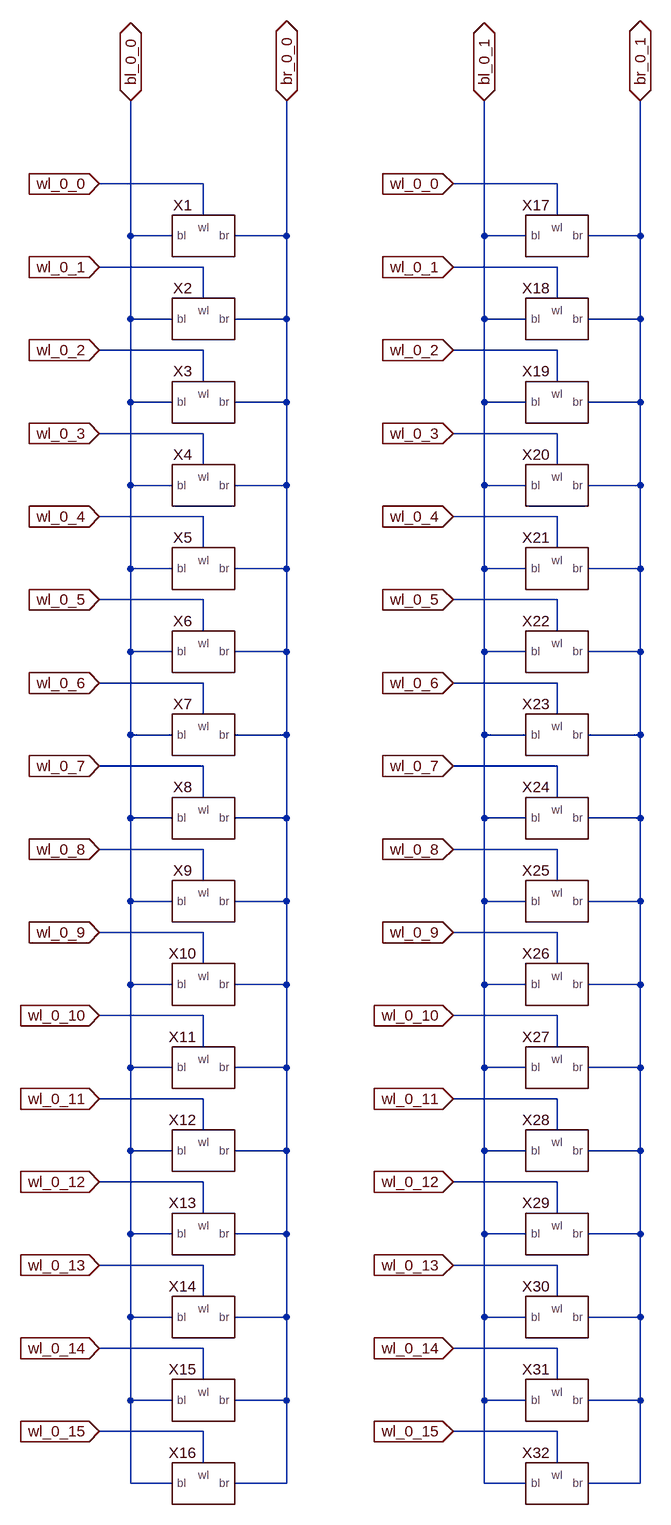
[diagram p0: schematic sram_16x2_bitcell_array.asc]
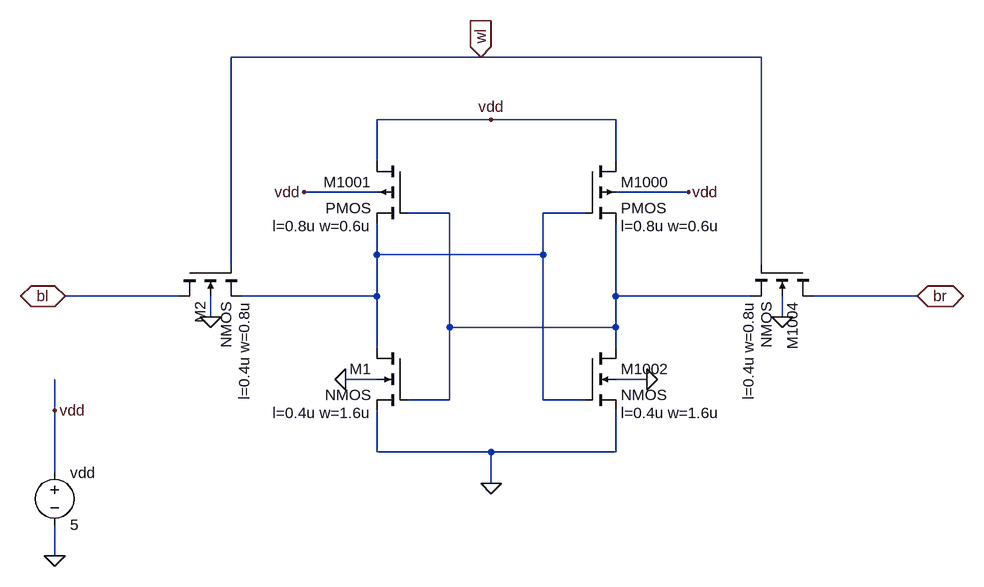
[diagram p1: sub-circuit cell_1rw.asc]
sram_16x2_bitcell_array.asc, the LTspice schematic file:
Version 4
SHEET 1 880 2100
WIRE 112 64 -48 64
WIRE 656 64 496 64
WIRE 112 112 112 64
WIRE 656 112 656 64
WIRE 0 144 0 -64
WIRE 64 144 0 144
WIRE 240 144 240 -64
WIRE 240 144 160 144
WIRE 544 144 544 -64
WIRE 608 144 544 144
WIRE 784 144 784 -64
WIRE 784 144 704 144
WIRE 112 192 -48 192
WIRE 656 192 496 192
WIRE 112 240 112 192
WIRE 656 240 656 192
WIRE 0 272 0 144
WIRE 64 272 0 272
WIRE 240 272 240 144
WIRE 240 272 160 272
WIRE 544 272 544 144
WIRE 608 272 544 272
WIRE 784 272 784 144
WIRE 784 272 704 272
WIRE 112 320 -48 320
WIRE 656 320 496 320
WIRE 112 368 112 320
WIRE 656 368 656 320
WIRE 0 400 0 272
WIRE 64 400 0 400
WIRE 240 400 240 272
WIRE 240 400 160 400
WIRE 544 400 544 272
WIRE 608 400 544 400
WIRE 784 400 784 272
WIRE 784 400 704 400
WIRE 112 448 -48 448
WIRE 656 448 496 448
WIRE 112 496 112 448
WIRE 656 496 656 448
WIRE 0 528 0 400
WIRE 64 528 0 528
WIRE 240 528 240 400
WIRE 240 528 160 528
WIRE 544 528 544 400
WIRE 608 528 544 528
WIRE 784 528 784 400
WIRE 784 528 704 528
WIRE 112 576 -48 576
WIRE 656 576 496 576
WIRE 112 624 112 576
WIRE 656 624 656 576
WIRE 0 656 0 528
WIRE 64 656 0 656
WIRE 240 656 240 528
WIRE 240 656 160 656
WIRE 544 656 544 528
WIRE 608 656 544 656
WIRE 784 656 784 528
WIRE 784 656 704 656
WIRE 112 704 -48 704
WIRE 656 704 496 704
WIRE 112 752 112 704
WIRE 656 752 656 704
WIRE 0 784 0 656
WIRE 64 784 0 784
WIRE 240 784 240 656
WIRE 240 784 160 784
WIRE 544 784 544 656
WIRE 608 784 544 784
WIRE 784 784 784 656
WIRE 784 784 704 784
WIRE 112 832 -48 832
WIRE 656 832 496 832
WIRE 112 880 112 832
WIRE 656 880 656 832
WIRE 0 912 0 784
WIRE 64 912 0 912
WIRE 240 912 240 784
WIRE 240 912 160 912
WIRE 544 912 544 784
WIRE 608 912 544 912
WIRE 784 912 784 784
WIRE 784 912 704 912
WIRE 112 960 -48 960
WIRE 656 960 496 960
WIRE 112 1008 112 960
WIRE 656 1008 656 960
WIRE 0 1040 0 912
WIRE 64 1040 0 1040
WIRE 240 1040 240 912
WIRE 240 1040 160 1040
WIRE 544 1040 544 912
WIRE 608 1040 544 1040
WIRE 784 1040 784 912
WIRE 784 1040 704 1040
WIRE 112 1088 -48 1088
WIRE 656 1088 496 1088
WIRE 112 1136 112 1088
WIRE 656 1136 656 1088
WIRE 0 1168 0 1040
WIRE 64 1168 0 1168
WIRE 240 1168 240 1040
WIRE 240 1168 160 1168
WIRE 544 1168 544 1040
WIRE 608 1168 544 1168
WIRE 784 1168 784 1040
WIRE 784 1168 704 1168
WIRE 112 1216 -48 1216
WIRE 656 1216 496 1216
WIRE 112 1264 112 1216
WIRE 656 1264 656 1216
WIRE 0 1296 0 1168
WIRE 64 1296 0 1296
WIRE 240 1296 240 1168
WIRE 240 1296 160 1296
WIRE 544 1296 544 1168
WIRE 608 1296 544 1296
WIRE 784 1296 784 1168
WIRE 784 1296 704 1296
WIRE 112 1344 -48 1344
WIRE 656 1344 496 1344
WIRE 112 1392 112 1344
WIRE 656 1392 656 1344
WIRE 0 1424 0 1296
WIRE 64 1424 0 1424
WIRE 240 1424 240 1296
WIRE 240 1424 160 1424
WIRE 544 1424 544 1296
WIRE 608 1424 544 1424
WIRE 784 1424 784 1296
WIRE 784 1424 704 1424
WIRE 112 1472 -48 1472
WIRE 656 1472 496 1472
WIRE 112 1520 112 1472
WIRE 656 1520 656 1472
WIRE 0 1552 0 1424
WIRE 64 1552 0 1552
WIRE 240 1552 240 1424
WIRE 240 1552 160 1552
WIRE 544 1552 544 1424
WIRE 608 1552 544 1552
WIRE 784 1552 784 1424
WIRE 784 1552 704 1552
WIRE 112 1600 -48 1600
WIRE 656 1600 496 1600
WIRE 112 1648 112 1600
WIRE 656 1648 656 1600
WIRE 0 1680 0 1552
WIRE 64 1680 0 1680
WIRE 240 1680 240 1552
WIRE 240 1680 160 1680
WIRE 544 1680 544 1552
WIRE 608 1680 544 1680
WIRE 784 1680 784 1552
WIRE 784 1680 704 1680
WIRE 112 1728 -48 1728
WIRE 656 1728 496 1728
WIRE 112 1776 112 1728
WIRE 656 1776 656 1728
WIRE 0 1808 0 1680
WIRE 64 1808 0 1808
WIRE 240 1808 240 1680
WIRE 240 1808 160 1808
WIRE 544 1808 544 1680
WIRE 608 1808 544 1808
WIRE 784 1808 784 1680
WIRE 784 1808 704 1808
WIRE 112 1856 -48 1856
WIRE 656 1856 496 1856
WIRE 112 1904 112 1856
WIRE 656 1904 656 1856
WIRE 0 1936 0 1808
WIRE 64 1936 0 1936
WIRE 240 1936 240 1808
WIRE 240 1936 160 1936
WIRE 544 1936 544 1808
WIRE 608 1936 544 1936
WIRE 784 1936 784 1808
WIRE 784 1936 704 1936
WIRE 112 1984 -48 1984
WIRE 656 1984 496 1984
WIRE 112 2032 112 1984
WIRE 656 2032 656 1984
WIRE 0 2064 0 1936
WIRE 64 2064 0 2064
WIRE 240 2064 240 1936
WIRE 240 2064 160 2064
WIRE 544 2064 544 1936
WIRE 608 2064 544 2064
WIRE 784 2064 784 1936
WIRE 784 2064 704 2064
FLAG -48 64 wl_0_0
IOPIN -48 64 In
FLAG -48 192 wl_0_1
IOPIN -48 192 In
FLAG -48 320 wl_0_2
IOPIN -48 320 In
FLAG -48 448 wl_0_3
IOPIN -48 448 In
FLAG -48 576 wl_0_4
IOPIN -48 576 In
FLAG -48 704 wl_0_5
IOPIN -48 704 In
FLAG -48 832 wl_0_6
IOPIN -48 832 In
FLAG -48 960 wl_0_7
IOPIN -48 960 In
FLAG -48 1088 wl_0_8
IOPIN -48 1088 In
FLAG -48 1216 wl_0_9
IOPIN -48 1216 In
FLAG -48 1344 wl_0_10
IOPIN -48 1344 In
FLAG -48 1472 wl_0_11
IOPIN -48 1472 In
FLAG -48 1600 wl_0_12
IOPIN -48 1600 In
FLAG -48 1728 wl_0_13
IOPIN -48 1728 In
FLAG -48 1856 wl_0_14
IOPIN -48 1856 In
FLAG -48 1984 wl_0_15
IOPIN -48 1984 In
FLAG 0 -64 bl_0_0
IOPIN 0 -64 BiDir
FLAG 240 -64 br_0_0
IOPIN 240 -64 BiDir
FLAG 496 64 wl_0_0
IOPIN 496 64 In
FLAG 496 192 wl_0_1
IOPIN 496 192 In
FLAG 496 320 wl_0_2
IOPIN 496 320 In
FLAG 496 448 wl_0_3
IOPIN 496 448 In
FLAG 496 576 wl_0_4
IOPIN 496 576 In
FLAG 496 704 wl_0_5
IOPIN 496 704 In
FLAG 496 832 wl_0_6
IOPIN 496 832 In
FLAG 496 960 wl_0_7
IOPIN 496 960 In
FLAG 496 1088 wl_0_8
IOPIN 496 1088 In
FLAG 496 1216 wl_0_9
IOPIN 496 1216 In
FLAG 496 1344 wl_0_10
IOPIN 496 1344 In
FLAG 496 1472 wl_0_11
IOPIN 496 1472 In
FLAG 496 1600 wl_0_12
IOPIN 496 1600 In
FLAG 496 1728 wl_0_13
IOPIN 496 1728 In
FLAG 496 1856 wl_0_14
IOPIN 496 1856 In
FLAG 496 1984 wl_0_15
IOPIN 496 1984 In
FLAG 544 -64 bl_0_1
IOPIN 544 -64 BiDir
FLAG 784 -64 br_0_1
IOPIN 784 -64 BiDir
SYMBOL cell_1rw 112 144 R0
SYMATTR InstName X1
SYMBOL cell_1rw 112 272 R0
SYMATTR InstName X2
SYMBOL cell_1rw 112 400 R0
SYMATTR InstName X3
SYMBOL cell_1rw 112 528 R0
SYMATTR InstName X4
SYMBOL cell_1rw 112 656 R0
SYMATTR InstName X5
SYMBOL cell_1rw 112 784 R0
SYMATTR InstName X6
SYMBOL cell_1rw 112 912 R0
SYMATTR InstName X7
SYMBOL cell_1rw 112 1040 R0
SYMATTR InstName X8
SYMBOL cell_1rw 112 1168 R0
SYMATTR InstName X9
SYMBOL cell_1rw 112 1296 R0
SYMATTR InstName X10
SYMBOL cell_1rw 112 1424 R0
SYMATTR InstName X11
SYMBOL cell_1rw 112 1552 R0
SYMATTR InstName X12
SYMBOL cell_1rw 112 1680 R0
SYMATTR InstName X13
SYMBOL cell_1rw 112 1808 R0
SYMATTR InstName X14
SYMBOL cell_1rw 112 1936 R0
SYMATTR InstName X15
SYMBOL cell_1rw 112 2064 R0
SYMATTR InstName X16
SYMBOL cell_1rw 656 144 R0
SYMATTR InstName X17
SYMBOL cell_1rw 656 272 R0
SYMATTR InstName X18
SYMBOL cell_1rw 656 400 R0
SYMATTR InstName X19
SYMBOL cell_1rw 656 528 R0
SYMATTR InstName X20
SYMBOL cell_1rw 656 656 R0
SYMATTR InstName X21
SYMBOL cell_1rw 656 784 R0
SYMATTR InstName X22
SYMBOL cell_1rw 656 912 R0
SYMATTR InstName X23
SYMBOL cell_1rw 656 1040 R0
SYMATTR InstName X24
SYMBOL cell_1rw 656 1168 R0
SYMATTR InstName X25
SYMBOL cell_1rw 656 1296 R0
SYMATTR InstName X26
SYMBOL cell_1rw 656 1424 R0
SYMATTR InstName X27
SYMBOL cell_1rw 656 1552 R0
SYMATTR InstName X28
SYMBOL cell_1rw 656 1680 R0
SYMATTR InstName X29
SYMBOL cell_1rw 656 1808 R0
SYMATTR InstName X30
SYMBOL cell_1rw 656 1936 R0
SYMATTR InstName X31
SYMBOL cell_1rw 656 2064 R0
SYMATTR InstName X32

cell_1rw.asc, the sub-circuit schematic file:
Version 4
SHEET 1 916 708
WIRE 160 -80 -224 -80
WIRE 592 -80 160 -80
WIRE 176 16 0 16
WIRE 368 16 176 16
WIRE 0 80 0 16
WIRE 368 80 368 16
WIRE 0 128 -112 128
WIRE 480 128 368 128
WIRE 112 160 48 160
WIRE 320 160 256 160
WIRE 0 224 0 176
WIRE 256 224 256 160
WIRE 256 224 0 224
WIRE -224 240 -224 -80
WIRE 592 240 592 -80
WIRE -304 288 -480 288
WIRE 0 288 0 224
WIRE 0 288 -208 288
WIRE 368 288 368 176
WIRE 576 288 368 288
WIRE 832 288 672 288
WIRE -256 320 -256 288
WIRE 624 320 624 288
WIRE 112 336 112 160
WIRE 368 336 368 288
WIRE 368 336 112 336
WIRE 0 368 0 288
WIRE 368 368 368 336
WIRE 0 416 -48 416
WIRE 416 416 368 416
WIRE 112 448 112 336
WIRE 112 448 48 448
WIRE 256 448 256 224
WIRE 320 448 256 448
WIRE -496 464 -496 416
WIRE 0 528 0 464
WIRE 176 528 0 528
WIRE 368 528 368 464
WIRE 368 528 176 528
WIRE -496 560 -496 464
WIRE 176 576 176 528
WIRE -496 688 -496 640
FLAG 176 576 0
FLAG -496 688 0
FLAG -496 464 vdd
FLAG 176 16 vdd
FLAG 416 416 0
FLAG -48 416 0
FLAG 624 320 0
FLAG -256 320 0
FLAG -112 128 vdd
FLAG 480 128 vdd
FLAG -480 288 bl
IOPIN -480 288 BiDir
FLAG 160 -80 wl
IOPIN 160 -80 In
FLAG 832 288 br
IOPIN 832 288 BiDir
SYMBOL pmos4 320 80 R0
WINDOW 123 56 100 Left 2
SYMATTR InstName M1000
SYMATTR Value2 l=0.8u w=0.6u
SYMBOL pmos4 48 80 M0
WINDOW 123 56 100 Left 2
SYMATTR InstName M1001
SYMATTR Value2 l=0.8u w=0.6u
SYMBOL nmos4 320 368 R0
WINDOW 123 56 100 Left 2
SYMATTR InstName M1002
SYMATTR Value2 l=0.4u w=1.6u
SYMBOL nmos4 48 368 M0
WINDOW 123 56 100 Left 2
SYMATTR InstName M1
SYMATTR Value2 l=0.4u w=1.6u
SYMBOL voltage -496 544 R0
WINDOW 123 0 0 Left 0
WINDOW 39 0 0 Left 0
SYMATTR InstName vdd
SYMATTR Value 5
SYMBOL nmos4 672 240 R90
WINDOW 123 56 100 Left 2
SYMATTR InstName M1004
SYMATTR Value2 l=0.4u w=0.8u
SYMBOL nmos4 -304 240 M90
WINDOW 123 56 100 Left 2
SYMATTR InstName M2
SYMATTR Value2 l=0.4u w=0.8u

The netlist it stands for:
* sram_16x2_bitcell_array.asc
XX1 wl_0_0 bl_0_0 br_0_0 cell_1rw
XX2 wl_0_1 bl_0_0 br_0_0 cell_1rw
XX3 wl_0_2 bl_0_0 br_0_0 cell_1rw
XX4 wl_0_3 bl_0_0 br_0_0 cell_1rw
XX5 wl_0_4 bl_0_0 br_0_0 cell_1rw
XX6 wl_0_5 bl_0_0 br_0_0 cell_1rw
XX7 wl_0_6 bl_0_0 br_0_0 cell_1rw
XX8 wl_0_7 bl_0_0 br_0_0 cell_1rw
XX9 wl_0_8 bl_0_0 br_0_0 cell_1rw
XX10 wl_0_9 bl_0_0 br_0_0 cell_1rw
XX11 wl_0_10 bl_0_0 br_0_0 cell_1rw
XX12 wl_0_11 bl_0_0 br_0_0 cell_1rw
XX13 wl_0_12 bl_0_0 br_0_0 cell_1rw
XX14 wl_0_13 bl_0_0 br_0_0 cell_1rw
XX15 wl_0_14 bl_0_0 br_0_0 cell_1rw
XX16 wl_0_15 bl_0_0 br_0_0 cell_1rw
XX17 wl_0_0 bl_0_1 br_0_1 cell_1rw
XX18 wl_0_1 bl_0_1 br_0_1 cell_1rw
XX19 wl_0_2 bl_0_1 br_0_1 cell_1rw
XX20 wl_0_3 bl_0_1 br_0_1 cell_1rw
XX21 wl_0_4 bl_0_1 br_0_1 cell_1rw
XX22 wl_0_5 bl_0_1 br_0_1 cell_1rw
XX23 wl_0_6 bl_0_1 br_0_1 cell_1rw
XX24 wl_0_7 bl_0_1 br_0_1 cell_1rw
XX25 wl_0_8 bl_0_1 br_0_1 cell_1rw
XX26 wl_0_9 bl_0_1 br_0_1 cell_1rw
XX27 wl_0_10 bl_0_1 br_0_1 cell_1rw
XX28 wl_0_11 bl_0_1 br_0_1 cell_1rw
XX29 wl_0_12 bl_0_1 br_0_1 cell_1rw
XX30 wl_0_13 bl_0_1 br_0_1 cell_1rw
XX31 wl_0_14 bl_0_1 br_0_1 cell_1rw
XX32 wl_0_15 bl_0_1 br_0_1 cell_1rw

* block symbol definitions
.subckt cell_1rw wl bl br
M1000 vdd N002 N001 vdd PMOS l=0.8u w=0.6u
M1001 vdd N001 N002 vdd PMOS l=0.8u w=0.6u
M1002 N001 N002 0 0 NMOS l=0.4u w=1.6u
M1 N002 N001 0 0 NMOS l=0.4u w=1.6u
vdd vdd 0 5
M1004 br wl N001 0 NMOS l=0.4u w=0.8u
M2 bl wl N002 0 NMOS l=0.4u w=0.8u
.ends cell_1rw

.model NMOS NMOS
.model PMOS PMOS
.lib standard.mos
.backanno
.end